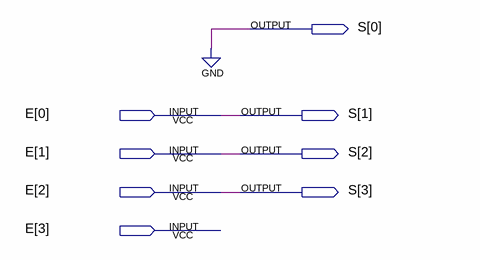
[diagram p0: schematic sheet]
// Quartus schematic shift_l.bdf as structural Verilog: 0 symbols, 8 pins
module shift_l (
  input  [3:0] E,
  output [3:0] S
);


  assign S = {E[2:0], 1'b0};
endmodule
